# Altium project Perron038 Altium.PrjPcb
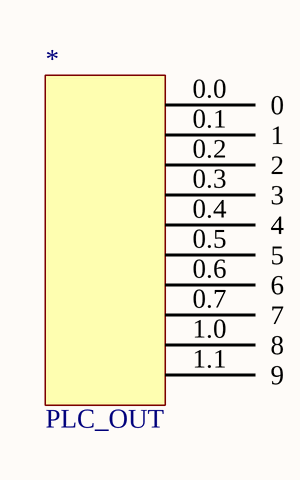
[diagram p0: TopLevel.SchDoc]
2 sheets, 3 parts. Net scope: global (net labels, ports and power ports of the same name join across sheets).
Sheets:
  TopLevel.SchDoc
  PLC.SchDoc

## Sheet TopLevel.SchDoc
size A4; SheetNumber: 1; SheetTotal: 2

### Parts
(Parts that share a designator on the sheet are numbered #1, #2 ... from top to bottom, then left to right.)
*#1  PLC_OUT

### Nets

Not connected (* = marked no-connect by the designer): *#1 0.0(0) 0.1(1) 0.2(2) 0.3(3) 0.4(4) 0.5(5) 0.6(6) 0.7(7) 1.0(8) 1.1(9)

## Sheet PLC.SchDoc
size A4; SheetNumber: 2; SheetTotal: 2
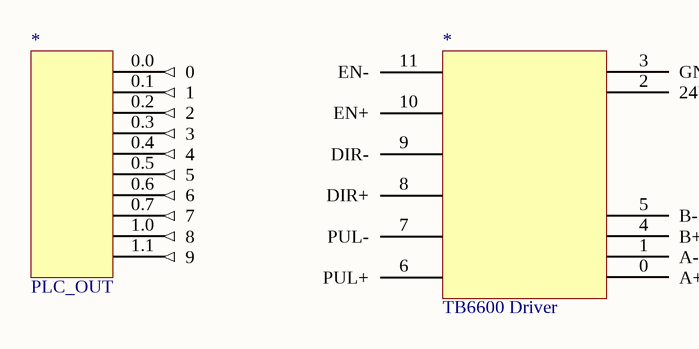
[diagram p1: PLC.SchDoc]

### Parts
(Parts that share a designator on the sheet are numbered #1, #2 ... from top to bottom, then left to right.)
*#2  TB6600 Driver
*#3  PLC_OUT

### Nets

Not connected (* = marked no-connect by the designer): *#2 0(A+) 1(A-) 2(24V) 3(GND) 4(B+) 5(B-) 6(PUL+) 7(PUL-) 8(DIR+) 9(DIR-) 10(EN+) 11(EN-); *#3 0.0(0) 0.1(1) 0.2(2) 0.3(3) 0.4(4) 0.5(5) 0.6(6) 0.7(7) 1.0(8) 1.1(9)